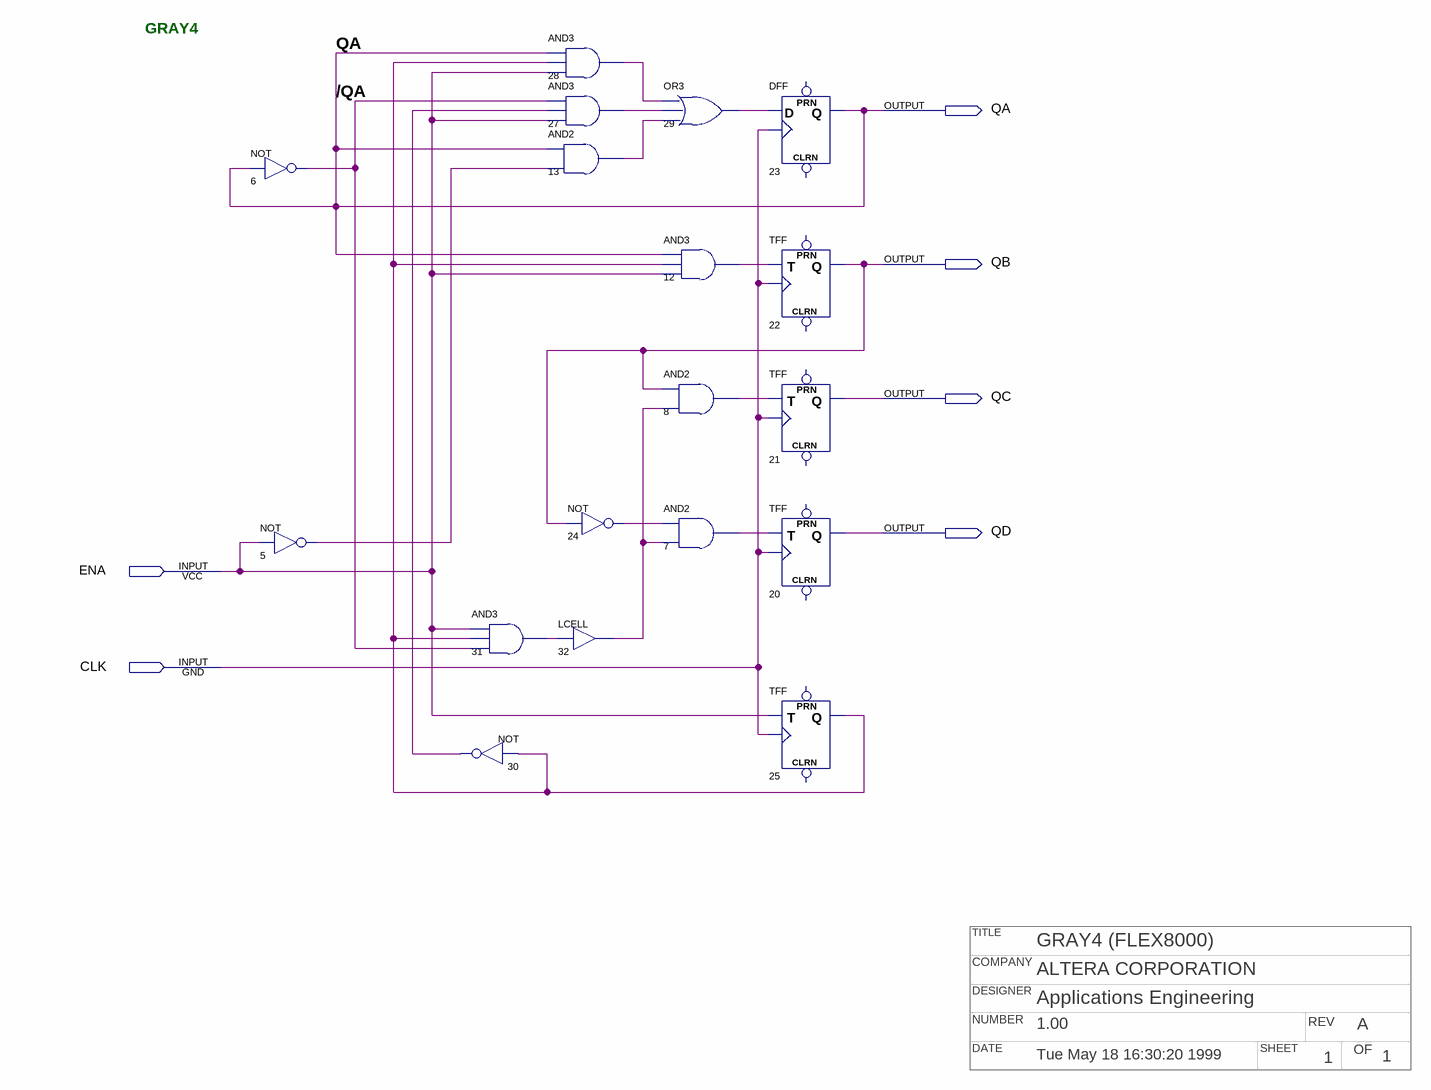
[diagram p0: schematic sheet]
// Quartus schematic fgray4.bdf as structural Verilog: 18 symbols, 6 pins
// Title block: TITLE: GRAY4 (FLEX8000); COMPANY: ALTERA CORPORATION; DESIGNER: Applications Engineering; NUMBER: 1.00; REV: A; DATE: Tue May 18 16:30:20 1999; SHEET: 1; OF: 1
module fgray4 (
  input  ENA,
  input  CLK,
  output QA,
  output QB,
  output QC,
  output QD
);

  wire \/QA , n5_out, n7_out, n8_out, n12_out, n13_out, n24_out, n25_q, n27_out, n28_out, n29_out, n30_out,
       n31_out, n32_out;

  not u_6 (\/QA , QA);
  not u_5 (n5_out, ENA);
  and u_31 (n31_out, ENA, n25_q, \/QA );
  not u_30 (n30_out, n25_q);
  and u_28 (n28_out, QA, n25_q, ENA);
  and u_27 (n27_out, \/QA , n30_out, ENA);
  and u_13 (n13_out, QA, n5_out);
  not u_24 (n24_out, QB);
  LCELL u_32 (.IN(n31_out), .OUT(n32_out));
  or u_29 (n29_out, n28_out, n27_out, n13_out);
  and u_12 (n12_out, QA, n25_q, ENA);
  and u_8 (n8_out, QB, n32_out);
  and u_7 (n7_out, n24_out, n32_out);
  DFF u_23 (.CLK(CLK), .D(n29_out), .Q(QA));  // open: CLRN, PRN
  TFF u_22 (.T(n12_out), .CLK(CLK), .Q(QB));  // open: PRN, CLRN
  TFF u_21 (.T(n8_out), .CLK(CLK), .Q(QC));  // open: PRN, CLRN
  TFF u_20 (.T(n7_out), .CLK(CLK), .Q(QD));  // open: PRN, CLRN
  TFF u_25 (.T(ENA), .CLK(CLK), .Q(n25_q));  // open: PRN, CLRN

  // Notes on the sheet:
  //   GRAY4
endmodule
